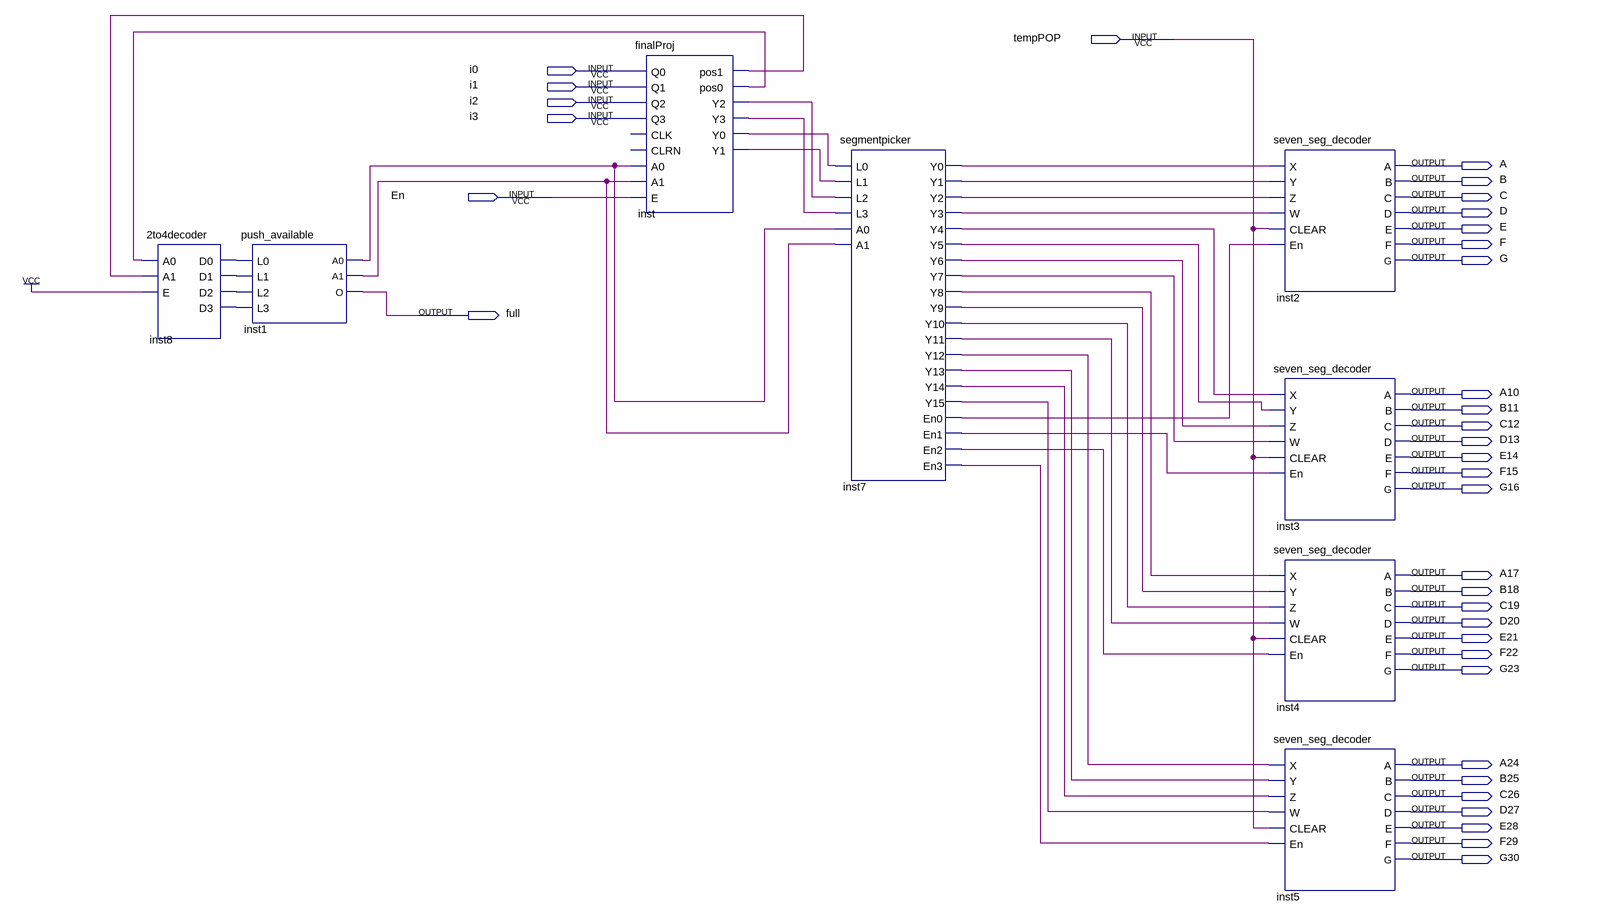
[diagram p0: schematic sheet]
// Quartus schematic push.bdf as structural Verilog: 8 symbols, 35 pins
module push (
  input  tempPOP,
  input  i0,
  input  i1,
  input  i2,
  input  i3,
  input  En,
  output A,
  output B,
  output C,
  output D,
  output E,
  output F,
  output G,
  output full,
  output A10,
  output B11,
  output C12,
  output D13,
  output E14,
  output F15,
  output G16,
  output A17,
  output B18,
  output C19,
  output D20,
  output E21,
  output F22,
  output G23,
  output A24,
  output B25,
  output C26,
  output D27,
  output E28,
  output F29,
  output G30
);

  wire inst1_a0, inst1_a1, inst7_en0, inst7_en1, inst7_en2, inst7_en3, inst7_y0, inst7_y1, inst7_y2,
       inst7_y3, inst7_y4, inst7_y5, inst7_y6, inst7_y7, inst7_y8, inst7_y9, inst7_y10, inst7_y11, inst7_y12,
       inst7_y13, inst7_y14, inst7_y15, inst8_d0, inst8_d1, inst8_d2, inst8_d3, inst_pos0, inst_pos1,
       inst_y0, inst_y1, inst_y2, inst_y3;

  \2to4decoder  inst8 (
    .A0(inst_pos0), .A1(inst_pos1), .E(1'b1), .D0(inst8_d0), .D1(inst8_d1), .D2(inst8_d2), .D3(inst8_d3));
  push_available inst1 (
    .L0(inst8_d0), .L1(inst8_d1), .L2(inst8_d2), .L3(inst8_d3), .A0(inst1_a0), .A1(inst1_a1), .O(full));
  finalProj inst (
    .Q0(i0), .Q1(i1), .Q2(i2), .Q3(i3), .A0(inst1_a0), .A1(inst1_a1), .E(En), .pos1(inst_pos1),
    .pos0(inst_pos0), .Y2(inst_y2), .Y3(inst_y3), .Y0(inst_y0), .Y1(inst_y1));  // open: CLK, CLRN
  segmentpicker inst7 (
    .L0(inst_y0), .L1(inst_y1), .L2(inst_y2), .L3(inst_y3), .A0(inst1_a0), .A1(inst1_a1), .Y0(inst7_y0),
    .Y1(inst7_y1), .Y2(inst7_y2), .Y3(inst7_y3), .Y4(inst7_y4), .Y5(inst7_y5), .Y6(inst7_y6), .Y7(inst7_y7),
    .Y8(inst7_y8), .Y9(inst7_y9), .Y10(inst7_y10), .Y11(inst7_y11), .Y12(inst7_y12), .Y13(inst7_y13),
    .Y14(inst7_y14), .Y15(inst7_y15), .En0(inst7_en0), .En1(inst7_en1), .En2(inst7_en2), .En3(inst7_en3));
  seven_seg_decoder inst2 (
    .X(inst7_y0), .Y(inst7_y1), .Z(inst7_y2), .W(inst7_y3), .CLEAR(tempPOP), .En(inst7_en0), .A(A), .B(B),
    .C(C), .D(D), .E(E), .F(F), .G(G));
  seven_seg_decoder inst3 (
    .X(inst7_y4), .Y(inst7_y5), .Z(inst7_y6), .W(inst7_y7), .CLEAR(tempPOP), .En(inst7_en1), .A(A10),
    .B(B11), .C(C12), .D(D13), .E(E14), .F(F15), .G(G16));
  seven_seg_decoder inst4 (
    .X(inst7_y8), .Y(inst7_y9), .Z(inst7_y10), .W(inst7_y11), .CLEAR(tempPOP), .En(inst7_en2), .A(A17),
    .B(B18), .C(C19), .D(D20), .E(E21), .F(F22), .G(G23));
  seven_seg_decoder inst5 (
    .X(inst7_y12), .Y(inst7_y13), .Z(inst7_y14), .W(inst7_y15), .CLEAR(tempPOP), .En(inst7_en3), .A(A24),
    .B(B25), .C(C26), .D(D27), .E(E28), .F(F29), .G(G30));
endmodule
